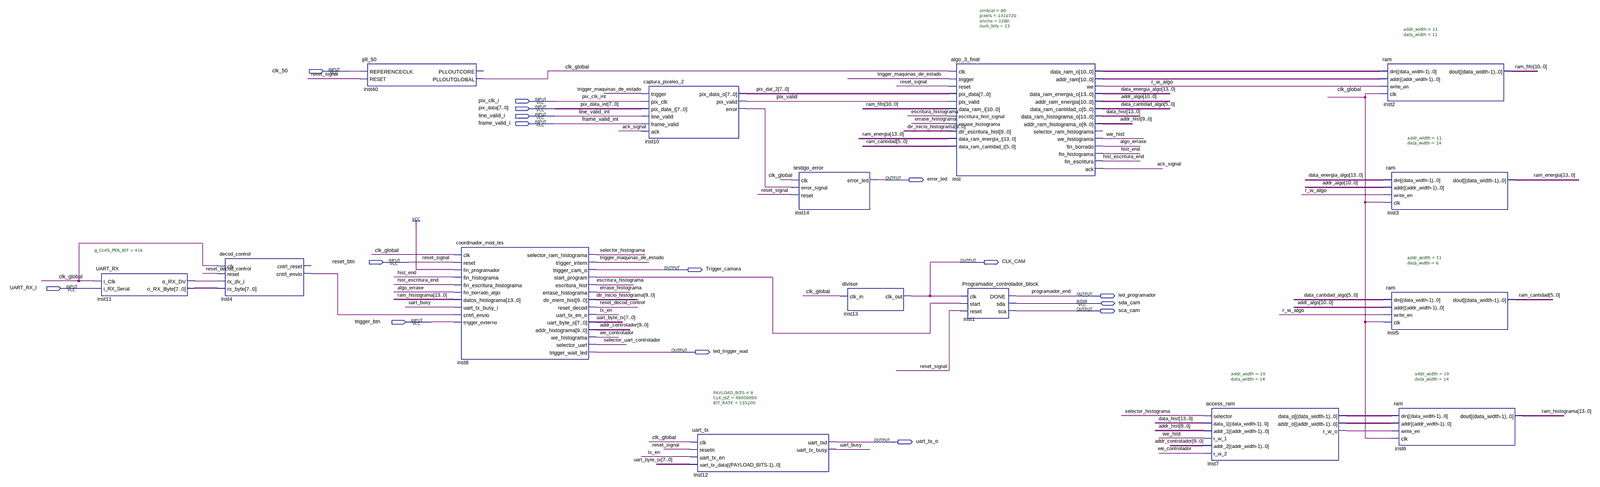
[diagram p0: schematic sheet, whole]
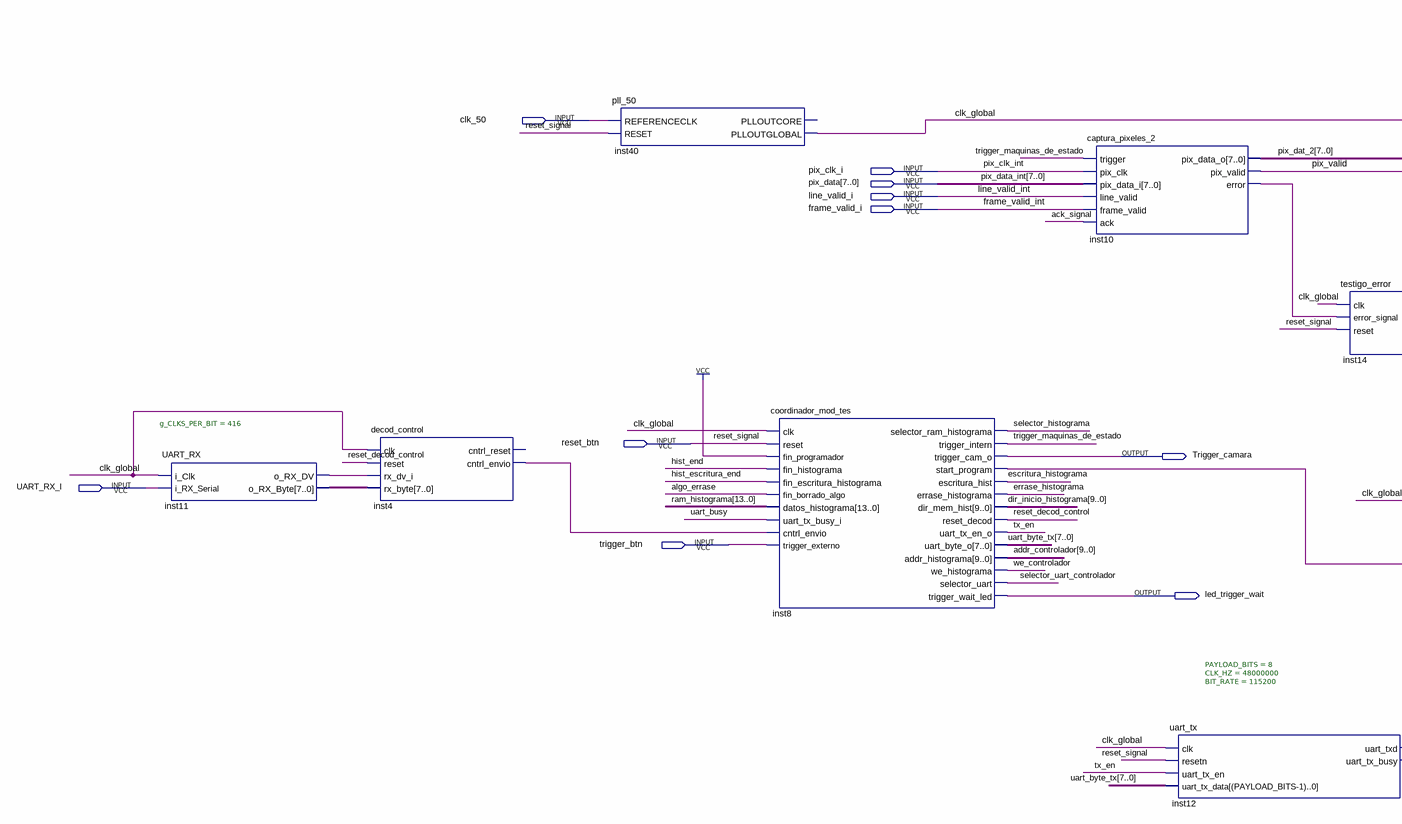
[diagram p1: schematic sheet, left part]
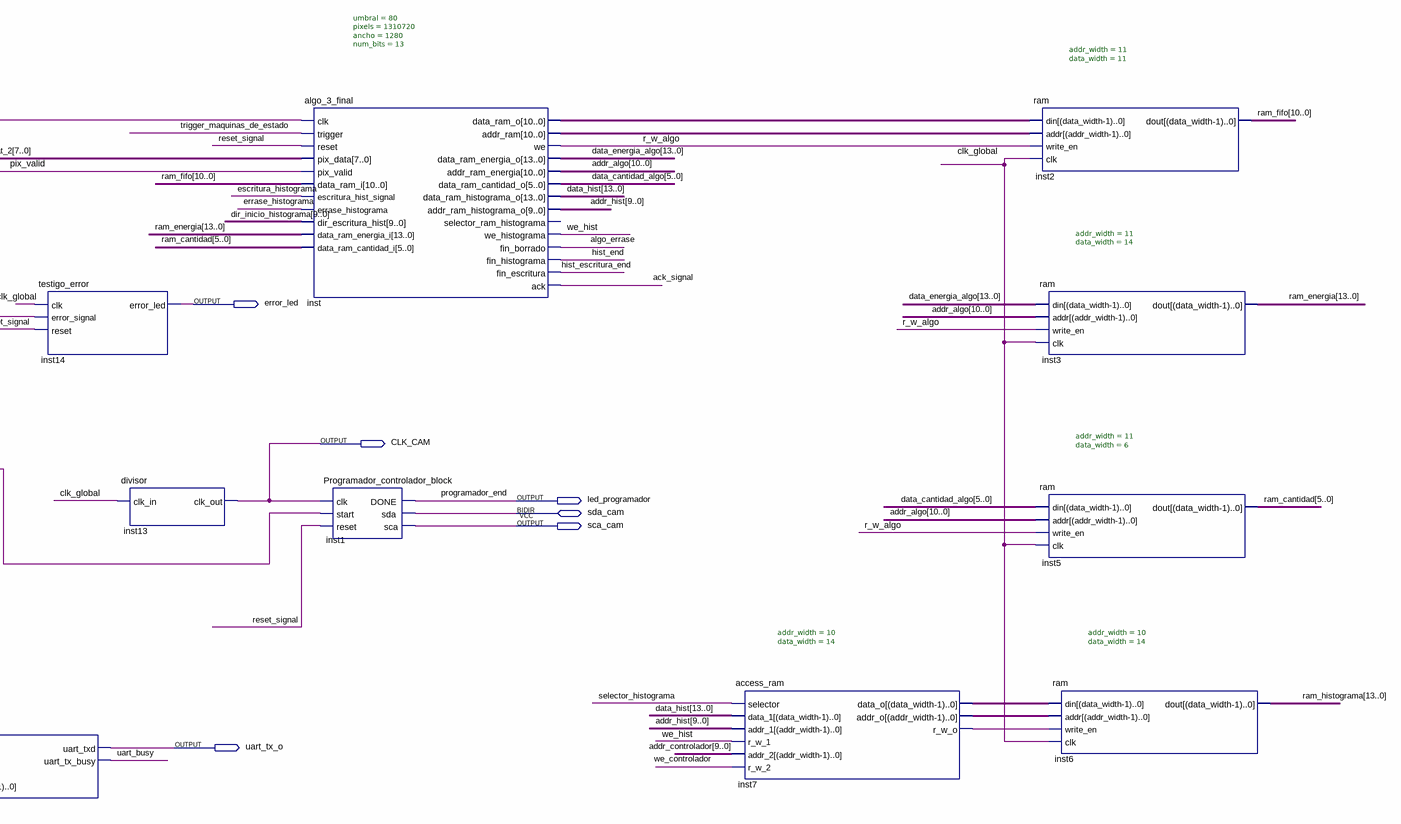
[diagram p2: schematic sheet, right part]
// Quartus schematic Parte_CIAA.bdf as structural Verilog: 15 symbols, 16 pins
module Parte_CIAA (
  input  clk_50,
  input  pix_clk_i,
  input  [7:0] pix_data,
  input  line_valid_i,
  input  frame_valid_i,
  input  reset_btn,
  input  UART_RX_I,
  input  trigger_btn,
  inout  sda_cam,
  output error_led,
  output CLK_CAM,
  output Trigger_camara,
  output led_programador,
  output sca_cam,
  output led_trigger_wait,
  output uart_tx_o
);

  wire ack_signal, algo_errase, clk_global, errase_histograma, escritura_histograma, hist_end,
       hist_escritura_end, inst4_cntrl_envio, inst7_r_w_o, inst8_start_program, inst10_error, inst11_o_rx_dv,
       pix_valid, r_w_algo, reset_decod_control, selector_histograma, selector_uart_controlador,
       trigger_maquinas_de_estado, tx_en, uart_busy, we_controlador, we_hist;
  wire [5:0] data_cantidad_algo, ram_cantidad;
  wire [7:0] inst11_o_rx_byte, pix_dat_2, uart_byte_tx;
  wire [9:0] addr_controlador, addr_hist, dir_inicio_histograma, inst7_addr_o;
  wire [10:0] addr_algo, inst_addr_ram, inst_data_ram_o, ram_fifo;
  wire [13:0] data_energia_algo, data_hist, inst7_data_o, ram_energia, ram_histograma;

  UART_RX #(.g_CLKS_PER_BIT(416)) inst11 (
    .i_Clk(clk_global), .i_RX_Serial(UART_RX_I), .o_RX_DV(inst11_o_rx_dv), .o_RX_Byte(inst11_o_rx_byte));
  decod_control inst4 (
    .clk(clk_global), .reset(reset_decod_control), .rx_dv_i(inst11_o_rx_dv), .rx_byte(inst11_o_rx_byte),
    .cntrl_envio(inst4_cntrl_envio));  // open: cntrl_reset
  pll_50 inst40 (.REFERENCECLK(clk_50), .RESET(reset_btn), .PLLOUTGLOBAL(clk_global));  // open: PLLOUTCORE
  coordinador_mod_tes inst8 (
    .clk(clk_global), .reset(reset_btn), .fin_programador(1'b1), .fin_histograma(hist_end),
    .fin_escritura_histograma(hist_escritura_end), .fin_borrado_algo(algo_errase),
    .datos_histograma(ram_histograma), .uart_tx_busy_i(uart_busy), .cntrl_envio(inst4_cntrl_envio),
    .trigger_externo(trigger_btn), .selector_ram_histograma(selector_histograma),
    .trigger_intern(trigger_maquinas_de_estado), .trigger_cam_o(Trigger_camara),
    .start_program(inst8_start_program), .escritura_hist(escritura_histograma),
    .errase_histograma(errase_histograma), .dir_mem_hist(dir_inicio_histograma),
    .reset_decod(reset_decod_control), .uart_tx_en_o(tx_en), .uart_byte_o(uart_byte_tx),
    .addr_histograma(addr_controlador), .we_histograma(we_controlador),
    .selector_uart(selector_uart_controlador), .trigger_wait_led(led_trigger_wait));
  captura_pixeles_2 inst10 (
    .trigger(trigger_maquinas_de_estado), .pix_clk(pix_clk_i), .pix_data_i(pix_data),
    .line_valid(line_valid_i), .frame_valid(frame_valid_i), .ack(ack_signal), .pix_data_o(pix_dat_2),
    .pix_valid(pix_valid), .error(inst10_error));
  uart_tx #(.PAYLOAD_BITS(8), .CLK_HZ(48000000), .BIT_RATE(115200)) inst12 (
    .clk(clk_global), .resetn(reset_btn), .uart_tx_en(tx_en), .uart_tx_data(uart_byte_tx),
    .uart_txd(uart_tx_o), .uart_tx_busy(uart_busy));
  testigo_error inst14 (.clk(clk_global), .error_signal(inst10_error), .reset(reset_btn), .error_led(error_led));
  divisor inst13 (.clk_in(clk_global), .clk_out(CLK_CAM));
  algo_3_final #(.umbral(80), .pixels(1310720), .ancho(1280), .num_bits(13)) inst (
    .clk(clk_global), .trigger(trigger_maquinas_de_estado), .reset(reset_btn), .pix_data(pix_dat_2),
    .pix_valid(pix_valid), .data_ram_i(ram_fifo), .escritura_hist_signal(escritura_histograma),
    .errase_histograma(errase_histograma), .dir_escritura_hist(dir_inicio_histograma),
    .data_ram_energia_i(ram_energia), .data_ram_cantidad_i(ram_cantidad), .data_ram_o(inst_data_ram_o),
    .addr_ram(inst_addr_ram), .we(r_w_algo), .data_ram_energia_o(data_energia_algo),
    .addr_ram_energia(addr_algo), .data_ram_cantidad_o(data_cantidad_algo),
    .data_ram_histograma_o(data_hist), .addr_ram_histograma_o(addr_hist), .we_histograma(we_hist),
    .fin_borrado(algo_errase), .fin_histograma(hist_end), .fin_escritura(hist_escritura_end), .ack(ack_signal));  // open: selector_ram_histograma
  Programador_controlador_block inst1 (
    .clk(CLK_CAM), .start(inst8_start_program), .reset(reset_btn), .DONE(led_programador), .sca(sca_cam),
    .sda(sda_cam));
  access_ram #(.addr_width(10), .data_width(14)) inst7 (
    .selector(selector_histograma), .data_1(data_hist), .addr_1(addr_hist), .r_w_1(we_hist),
    .addr_2(addr_controlador), .r_w_2(we_controlador), .data_o(inst7_data_o), .addr_o(inst7_addr_o),
    .r_w_o(inst7_r_w_o));
  ram #(.addr_width(11), .data_width(11)) inst2 (
    .din(inst_data_ram_o), .addr(inst_addr_ram), .write_en(r_w_algo), .clk(clk_global), .dout(ram_fifo));
  ram #(.addr_width(11), .data_width(14)) inst3 (
    .din(data_energia_algo), .addr(addr_algo), .write_en(r_w_algo), .clk(clk_global), .dout(ram_energia));
  ram #(.addr_width(11), .data_width(6)) inst5 (
    .din(data_cantidad_algo), .addr(addr_algo), .write_en(r_w_algo), .clk(clk_global), .dout(ram_cantidad));
  ram #(.addr_width(10), .data_width(14)) inst6 (
    .din(inst7_data_o), .addr(inst7_addr_o), .write_en(inst7_r_w_o), .clk(clk_global), .dout(ram_histograma));

  // Other names for the same wires on the sheet: frame_valid_int = frame_valid_i; line_valid_int = line_valid_i;
  //   pix_clk_int = pix_clk_i; pix_data_int[7:0] = pix_data; programador_end = led_programador;
  //   reset_signal = reset_btn
endmodule
